# Altium project Encoder Board VER.PrjPcb
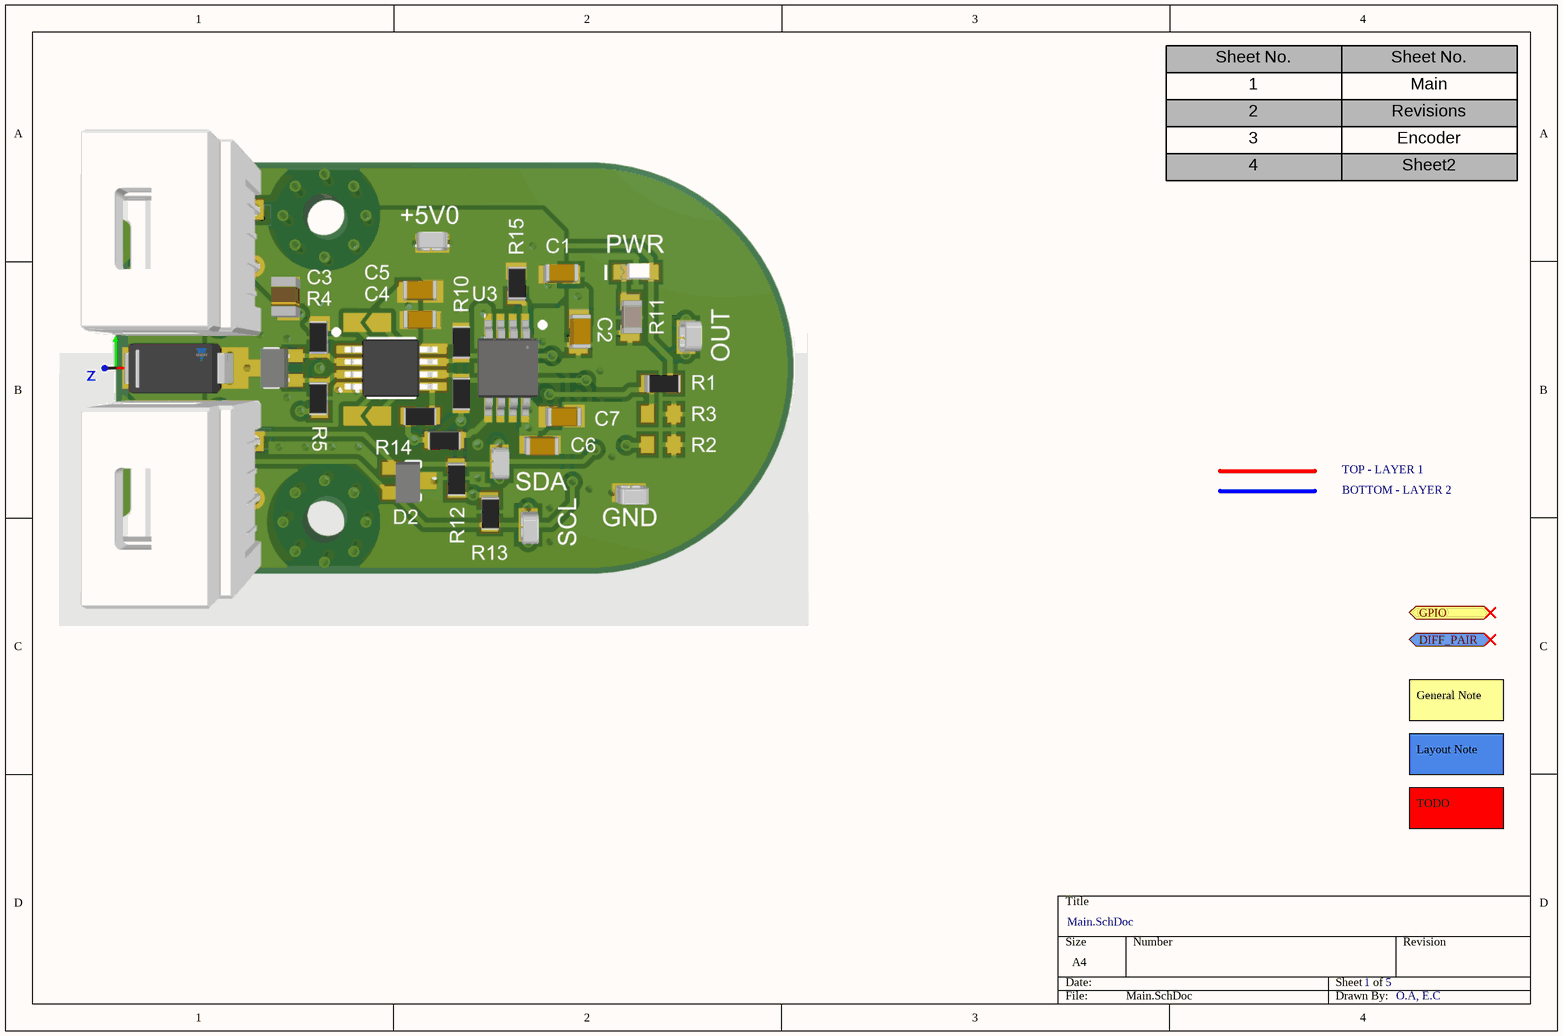
[diagram p0: Main.SchDoc]
3 sheets, 30 parts. Net scope: flat (ports and power ports of the same name join across sheets).
Board file: PCB.PcbDoc
Sheets:
  Main.SchDoc
  Connectors.SchDoc
  Bus Extender.SchDoc

## Sheet Main.SchDoc: =DocumentName
size A4; SheetNumber: 1; SheetTotal: 5

### Ports
DIFF_PAIR (bidir), GPIO (bidir)

### Notes on the sheet
- Sheet No.
- 1
- Main
- 2
- 3
- 4
- Revisions
- Encoder
- Sheet2
- TOP - LAYER 1
- BOTTOM - LAYER 2
- General Note
- Layout Note
- TODO
- O.A, E.C

## Sheet Connectors.SchDoc
size A4; SheetNumber: 4; SheetTotal: 5
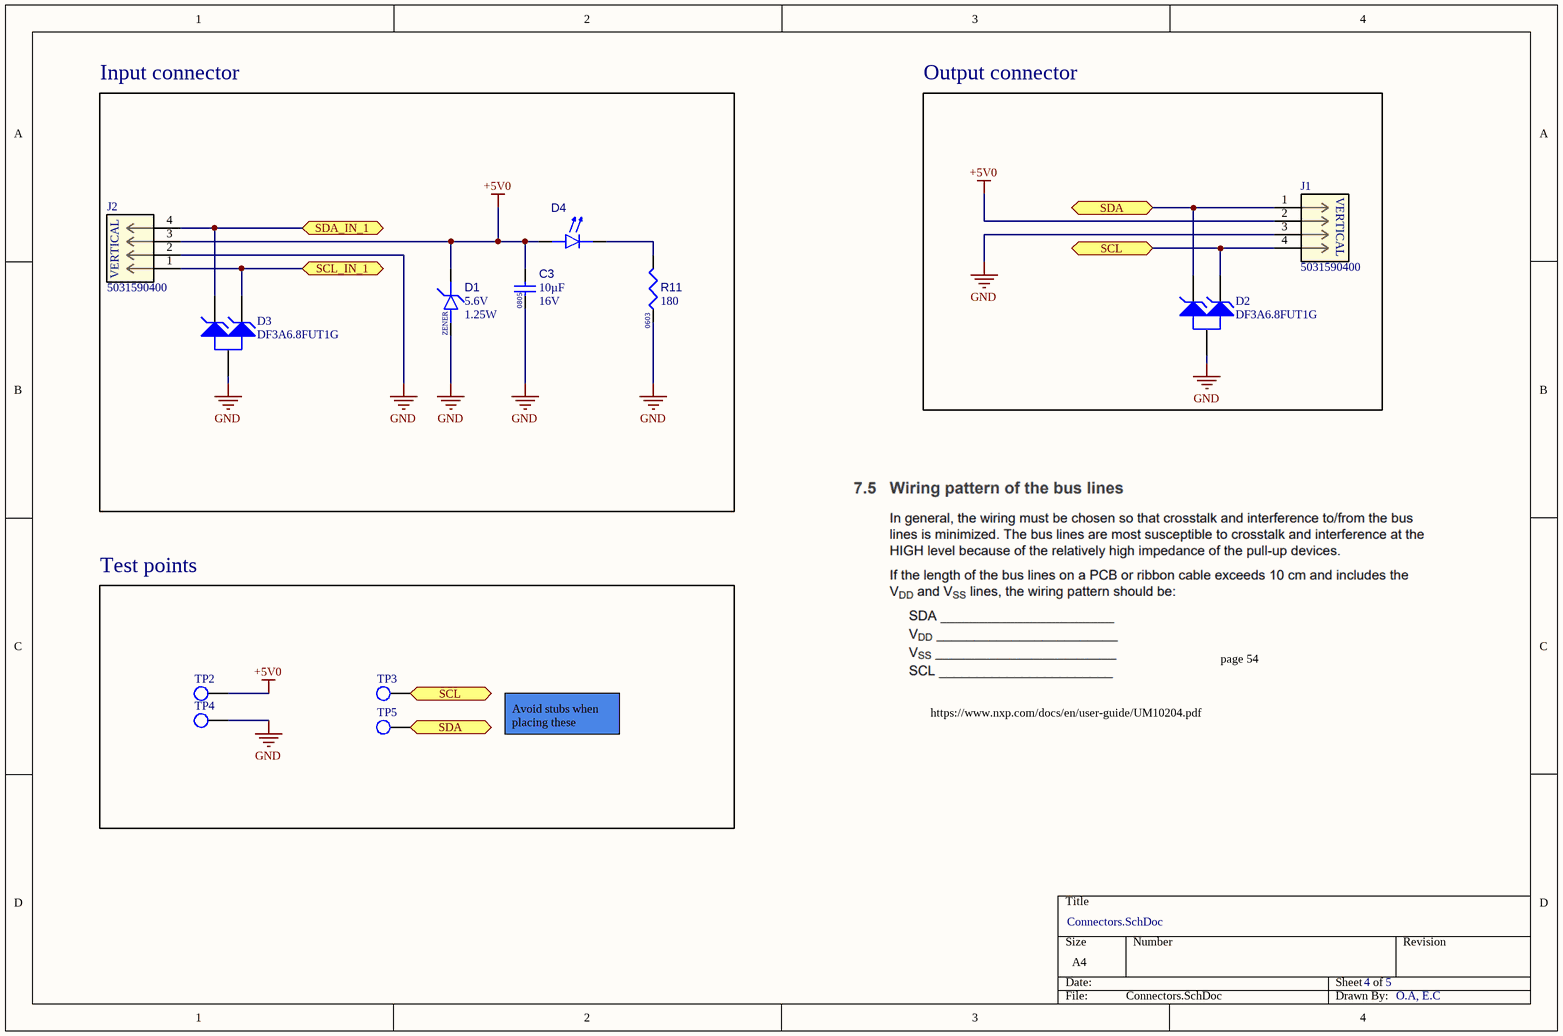
[diagram p1: Connectors.SchDoc]

### Parts
C3  value 10µF  Voltage Rating: 16V  Case/Package: 0805  [CAP CER 10UF 16V X5R 0805-Footprint-1]  (hidden comment: CAP CER 10UF 16V X5R 0805)
D1  Diode Type: ZENER  Reference Voltage-Nom: 5.6V  Max Power Dissipation: 1.25W  [FP-S8-V-3848_01-003-MFG]  (hidden comment: BZG05C5V6-M3-08)
D2  DF3A6.8FUT1G  [ONSC-SC-70-3-419-04_V]
D3  DF3A6.8FUT1G  [ONSC-SC-70-3-419-04_V]
D4  150060RS75000  [WL-SMCW_0603_150060xx75000]  (value not drawn)
J1  5031590400  [5031590400-Footprint-1]
J2  5031590400  [5031590400-Footprint-1]
R11  value 180  Case/Package: 0603  [RESC0603(1608)_N]  (hidden comment: RC0603JR-07180RL)
TP2  RCUCTE  [FP-S2761-46R-MFG]  (value not drawn)
TP3  RCUCTE  [FP-S2761-46R-MFG]  (value not drawn)
TP4  RCUCTE  [FP-S2761-46R-MFG]  (value not drawn)
TP5  RCUCTE  [FP-S2761-46R-MFG]  (value not drawn)

### Blocks framed on the sheet
Input connector: C3 D1 D3 D4 J2 R11
Output connector: D2 J1
Test points: TP2-TP5

### Ports
SCL (bidir), SCL_IN_1 (bidir), SDA (bidir), SDA_IN_1 (bidir)

### Nets
+5V0: C3.2 D1.1(K) D4.2(A) J1.2 J2.3 TP2.1
GND: C3.1 D1.2(A) D2.3(A) D3.3(A) J1.3 J2.2 R11.1 TP4.1
NetD2_1: D2.1(K1) J1.1 TP5.1 ; port SDA
NetD2_2: D2.2(K2) J1.4 TP3.1 ; port SCL
NetD3_1: D3.1(K1) J2.4 ; port SDA_IN_1
NetD3_2: D3.2(K2) J2.1 ; port SCL_IN_1
NetD4_1: D4.1(K) R11.2

### Notes on the sheet
- https://www.nxp.com/docs/en/user-guide/UM10204.pdf
- page 54
- Avoid stubs when placing these
- O.A, E.C
- (in symbol CMP-002-00073-2) VERTICAL

### Library data of the parts
C3 = CMP-001-00084-6: Ceramic Capacitor, Multilayer, Ceramic, 16V, 10% +Tol, 10% -Tol, X5R, 15% TC, 10uF, Surface Mount, 0805; Pins: 2; Capacitor Type: Ceramic; Max Operating Temperature: 85°C; Min Operating Temperature: -55°C; RoHS Compliant: Yes; Mounting Technology: Surface Mount
D1 = CMP-004-00042-1: Zener Diode, 5.6V V(Z), 7.14%, 1.25W, Silicon, Unidirectional, DO-214AC; Package Body Material: Plastic; Number of Elements: 1; Time @ Peak Reflow Temperature-Max (s): 30s; Test Current: 45mA; Additional Feature: HIGH RELIABILITY; RoHS Compliant: Yes; JEDEC-95 Code: DO-214AC; Pins: 2; JESD-30 Code: R-PDSO-C2; Terminal Position: DUAL; Package Style: SMALL OUTLINEMeter; Package Shape: Rectangular; JESD-609 Code: e3; Technology: ZENER; Moisture Sensitivity Level: 1; Surface Mount: Yes; Reach SVHC Compliant: No; Terminal Form: C BEND; Polarity: Unidirectional; Max Operating Temperature: 150°C; Peak Reflow Temperature (Cel): 260°C; Terminal Finish: Tin; Voltage Tol-Max: 7.14%; Diode Element Material: SILICON
D2 D3 = CMP-004-00039-1: Trans Voltage Suppressor Diode, 150W, Unidirectional, 2 Element, Silicon; Dynamic Impedance-Max: 50R; Time @ Peak Reflow Temperature-Max (s): 40s; Test Current: 5mA; Max Power Dissipation: 200mW; Package Body Material: Plastic; Number of Elements: 2; Voltage Tol-Max: 5.9%; Max Breakdown Voltage: 7.2V; Qualification Status: Not Qualified; Min Breakdown Voltage: 6.4V; Reference Voltage-Nom: 6.8V; Terminal Form: Gull Wing; Reach SVHC Compliant: Yes; Package Shape: Rectangular; Terminal Finish: Tin; Terminal Position: DUAL; JESD-609 Code: e3; Non-rep Peak Rev Power Dis-Max: 150W; Surface Mount: Yes; Diode Type: TRANS VOLTAGE SUPPRESSOR; Technology: ZENER; Polarity: Unidirectional; Max Operating Temperature: 150°C; Moisture Sensitivity Level: 1; Diode Element Material: SILICON; Min Operating Temperature: -55°C; Package Style: SMALL OUTLINEMeter; Pins: 3; Peak Reflow Temperature (Cel): 260°C; JESD-30 Code: R-PDSO-G3; RoHS Compliant: Yes
D4 = CMP-007-00036-1: Single Color LED, Red, Water Clear, 1.1mm; Forward Current: 30mA; Max Operating Temperature: 85°C; Mounting Technology: Surface Mount; RoHS Compliant: Yes; Pins: 2; Min Operating Temperature: -40°C
J1 J2 = CMP-002-00073-2: Board Connector, 4 Contact(s), 1 Row(s), Female, Straight, 0.059 inch Pitch, Solder Terminal, Locking, Beige Insulator, Receptacle; Mounting Technology: Board; Min Operating Temperature: -25°C; RoHS Compliant: Yes; Max Operating Temperature: 85°C; Connector Type: BOARD CONNECTOR
R11 = CMP-009-00178-1: Fixed Resistor, Metal Glaze/thick Film, 0.1W, 180ohm, 75V, 5% +/-Tol, 100ppm/Cel, Surface Mount, 0603; Power: 100mW; Tolerance: 5%; Pins: 2; Mounting Technology: Surface Mount; RoHS Compliant: Yes; Max Operating Temperature: 155°C; Min Operating Temperature: -55°C
TP2-TP5 = CMP-002-00072-5: Test point; Connector Type: Interconnection Device; Pins: 2; Max Operating Temperature: 125°C; Case/Package: 0603; Mounting Technology: Surface Mount; RoHS Compliant: Yes; Min Operating Temperature: -55°C

## Sheet Bus Extender.SchDoc
size A4; SheetNumber: 5; SheetTotal: 5
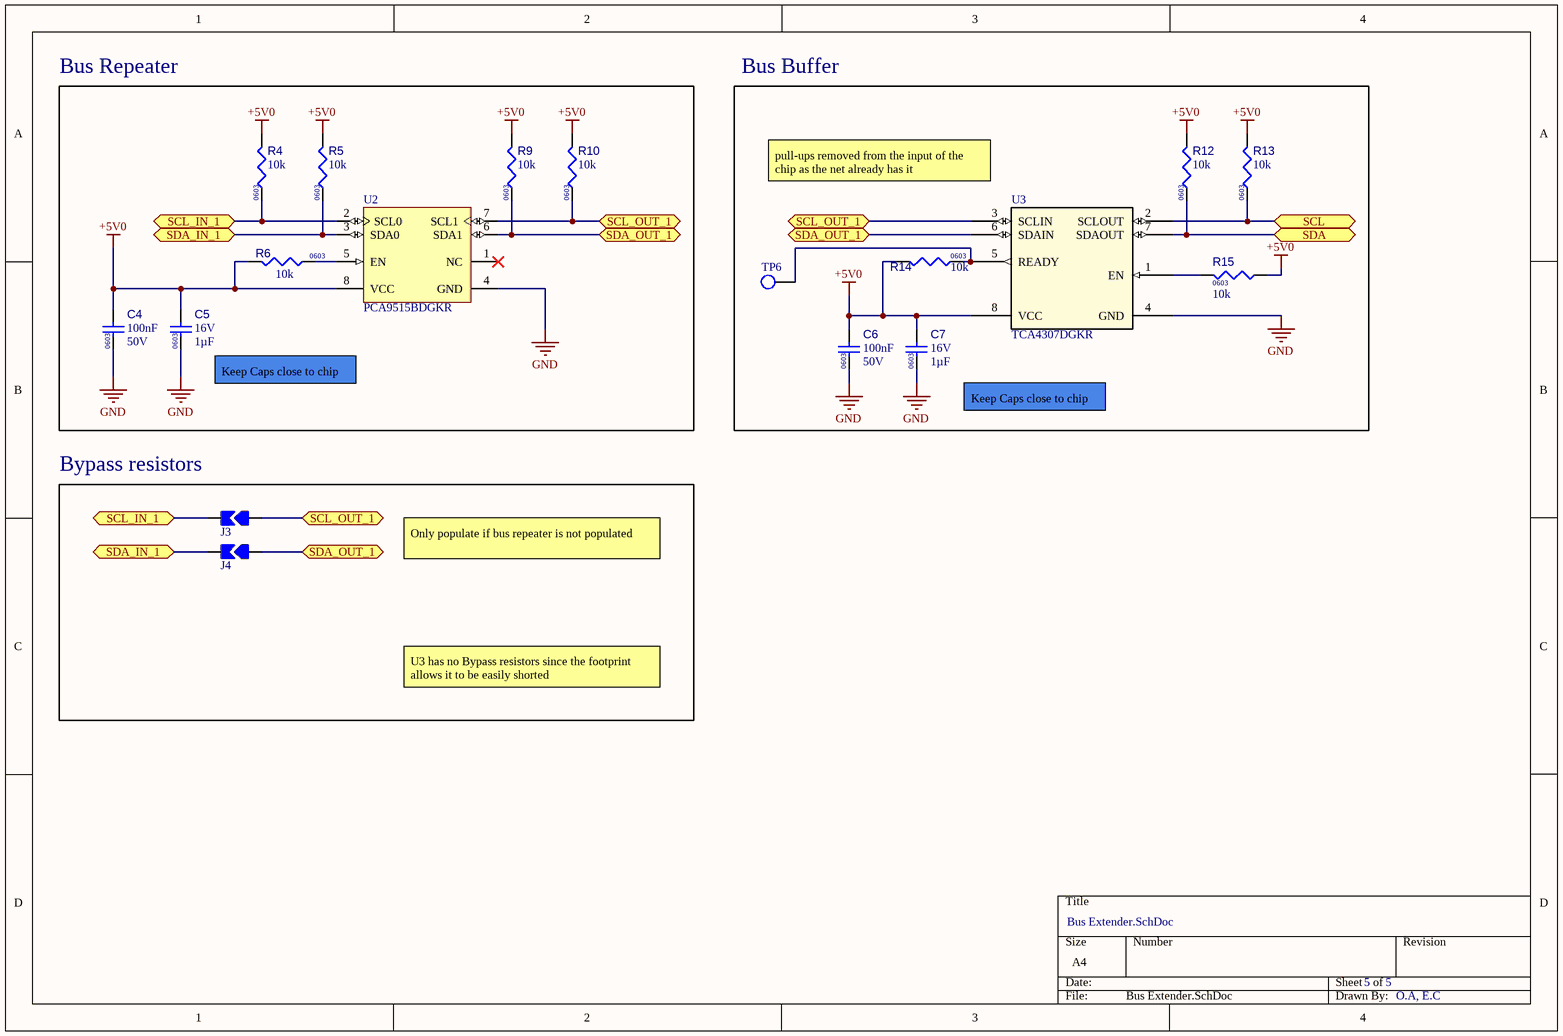
[diagram p2: Bus Extender.SchDoc]

### Parts
C4  value 100nF  Voltage Rating: 50V  Case/Package: 0603  [CAPC1608X90X40NL10T20]  (hidden comment: Capacitor 100 nF +/-10% 50 V 0603)
C5  value 1µF  Case/Package: 0603  Voltage Rating: 16V  [CAPC1608X90X35NL15T15]  (hidden comment: Capacitor 1uF +/- 10% 16V 0603)
C6  value 100nF  Voltage Rating: 50V  Case/Package: 0603  [CAPC1608X90X40NL10T20]  (hidden comment: Capacitor 100 nF +/-10% 50 V 0603)
C7  value 1µF  Case/Package: 0603  Voltage Rating: 16V  [CAPC1608X90X35NL15T15]  (hidden comment: Capacitor 1uF +/- 10% 16V 0603)
J3  Solder jumper  [New footprint 1]  (value not drawn)
J4  Solder jumper  [New footprint 1]  (value not drawn)
R4  value 10k  Case/Package: 0603  [RESC1608X55X25NL10T15]  (hidden comment: Resistor 10k +/-1% 0603 100 mW)
R5  value 10k  Case/Package: 0603  [RESC1608X55X25NL10T15]  (hidden comment: Resistor 10k +/-1% 0603 100 mW)
R6  value 10k  Case/Package: 0603  [RESC1608X55X25NL10T15]  (hidden comment: Resistor 10k +/-1% 0603 100 mW)
R9  value 10k  Case/Package: 0603  [RESC1608X55X25NL10T15]  (hidden comment: Resistor 10k +/-1% 0603 100 mW)
R10  value 10k  Case/Package: 0603  [RESC1608X55X25NL10T15]  (hidden comment: Resistor 10k +/-1% 0603 100 mW)
R12  value 10k  Case/Package: 0603  [RESC1608X55X25NL10T15]  (hidden comment: Resistor 10k +/-1% 0603 100 mW)
R13  value 10k  Case/Package: 0603  [RESC1608X55X25NL10T15]  (hidden comment: Resistor 10k +/-1% 0603 100 mW)
R14  value 10k  Case/Package: 0603  [RESC1608X55X25NL10T15]  (hidden comment: Resistor 10k +/-1% 0603 100 mW)
R15  value 10k  Case/Package: 0603  [RESC1608X55X25NL10T15]  (hidden comment: Resistor 10k +/-1% 0603 100 mW)
TP6  RCUCTE  [FP-S2761-46R-MFG]  (value not drawn)
U2  PCA9515BDGKR  [DGK0008A_L]
U3  TCA4307DGKR  [TCA4307DGKR-Footprint-1]

### Blocks framed on the sheet
Bus Repeater: C4 C5 R4-R6 R9 R10 U2
Bus Buffer: C6 C7 R12-R15 TP6 U3
Bypass resistors: J3 J4

### Ports
SCL (bidir), SCL_IN_1 (bidir), SCL_OUT_1 (bidir), SDA (bidir), SDA_IN_1 (bidir), SDA_OUT_1 (bidir)

### Nets
+5V0: C4.2 C5.2 C6.2 C7.2 R4.2 R5.2 R6.2 R9.2 R10.2 R12.2 R13.2 R14.2 R15.1 U2.8(VCC) U3.8(VCC)
GND: C4.1 C5.1 C6.1 C7.1 U2.4(GND) U3.4(GND)
NetD2_1: R12.1 U3.7(SDAOUT) ; port SDA
NetD2_2: R13.1 U3.2(SCLOUT) ; port SCL
NetD3_1: J4.2 R5.1 U2.3(SDA0) ; port SDA_IN_1
NetD3_2: J3.2 R4.1 U2.2(SCL0) ; port SCL_IN_1
NetJ3_1: J3.1 R10.1 U2.7(SCL1) U3.3(SCLIN) ; port SCL_OUT_1
NetJ4_1: J4.1 R9.1 U2.6(SDA1) U3.6(SDAIN) ; port SDA_OUT_1
NetR6_1: R6.1 U2.5(EN)
NetR14_1: R14.1 TP6.1 U3.5(READY)
NetR15_2: R15.2 U3.1(EN)

Not connected (* = marked no-connect by the designer): U2 1(NC)*

### Notes on the sheet
- (near U3) pull-ups removed from the input of the chip as the net already has it
- (near C5) Keep Caps close to chip
- Keep Caps close to chip
- Only populate if bus repeater is not populated
- U3 has no Bypass resistors since the footprint allows it to be easily shorted
- O.A, E.C

### Library data of the parts
C4 C6 = CMP-001-00017-8: Chip Capacitor, 100 nF, +/- 10%, 50 V, 0603 (1608 Metric); Capacitor Type: Ceramic; Tolerance: 10%; Mounting Technology: SM; Max Operating Temperature: 125°C; RoHS Compliant: True; Pins: 2; Min Operating Temperature: -55°C
C5 C7 = CMP-001-00004-8: Chip Capacitor, 1 uF, +/- 10%, 16 V, 0603 (1608 Metric); Capacitor Type: Ceramic; Mounting Technology: SM; RoHS Compliant: True; Min Operating Temperature: -55°C; Pins: 2; Max Operating Temperature: 125°C; Tolerance: 10%
J3 J4 = CMP-00030-00001-3
R4-R6 R9 R10 R12-R15 = CMP-009-00017-7: Chip Resistor, 10 KOhm, +/- 1%, 01 W, -55 to 155 degC, 0603 (1608 Metric); Voltage Rating: 50V; Power: 100mW; RoHS Compliant: True; Min Operating Temperature: -55°C; Pins: 2; Mounting Technology: SM; Max Operating Temperature: 155°C; Tolerance: 1%
TP6 = CMP-002-00072-5: as TP2 on sheet Connectors; Pins: 2; Max Operating Temperature: 125°C; Case/Package: 0603; Mounting Technology: Surface Mount; RoHS Compliant: Yes; Min Operating Temperature: -55°C
U2 = CMP-015-00014-2: Interface Circuit, BICMOS, PDSO8; Power Supplies: 2.5/3.3V; Package Body Material: Plastic; Min Supply Voltage: 2.3V; Nominal Supply Voltage: 2.5V; Channels: 1; Package Equivalence Code: TSSOP8,.19; Max Supply Voltage: 3.6V; Qualification Status: Not Qualified; Terminal Position: DUAL; Terminal Pitch: 0.65mm; Terminal Finish: Nickel; JESD-30 Code: S-PDSO-G8; RoHS Compliant: Yes; Surface Mount: Yes; Pins: 8; JESD-609 Code: e4; Height - Seated (Max): 1.1mm; Peak Reflow Temperature (Cel): 260°C; Package Style: SMALL OUTLINE, THIN PROFILE, SHRINK PITCHMeter; Interface IC Type: INTERFACE CIRCUIT; Min Operating Temperature: -40°C; Case/Package: TSSOP; Width: 3mm; Terminal Form: Gull Wing; Reach SVHC Compliant: Yes; Technology: BICMOS; Package Shape: Square; Temperature Grade: INDUSTRIAL; Moisture Sensitivity Level: 1; Max Operating Temperature: 85°C; Length: 3mm
U3 = CMP-015-00015-2: Interface Circuit, PDSO8

## Nets that join several sheets
+5V0: Connectors (6 pins), Bus Extender (15 pins)
GND: Connectors (8 pins), Bus Extender (6 pins)
NetD2_1: Connectors (D2.1 J1.1 TP5.1), Bus Extender (R12.1 U3.7)
NetD2_2: Connectors (D2.2 J1.4 TP3.1), Bus Extender (R13.1 U3.2)
NetD3_1: Connectors (D3.1 J2.4), Bus Extender (J4.2 R5.1 U2.3)
NetD3_2: Connectors (D3.2 J2.1), Bus Extender (J3.2 R4.1 U2.2)

## Assembly variants
REV_A: not fitted R4 R7 R8 R9 R10 R? R? R? U2